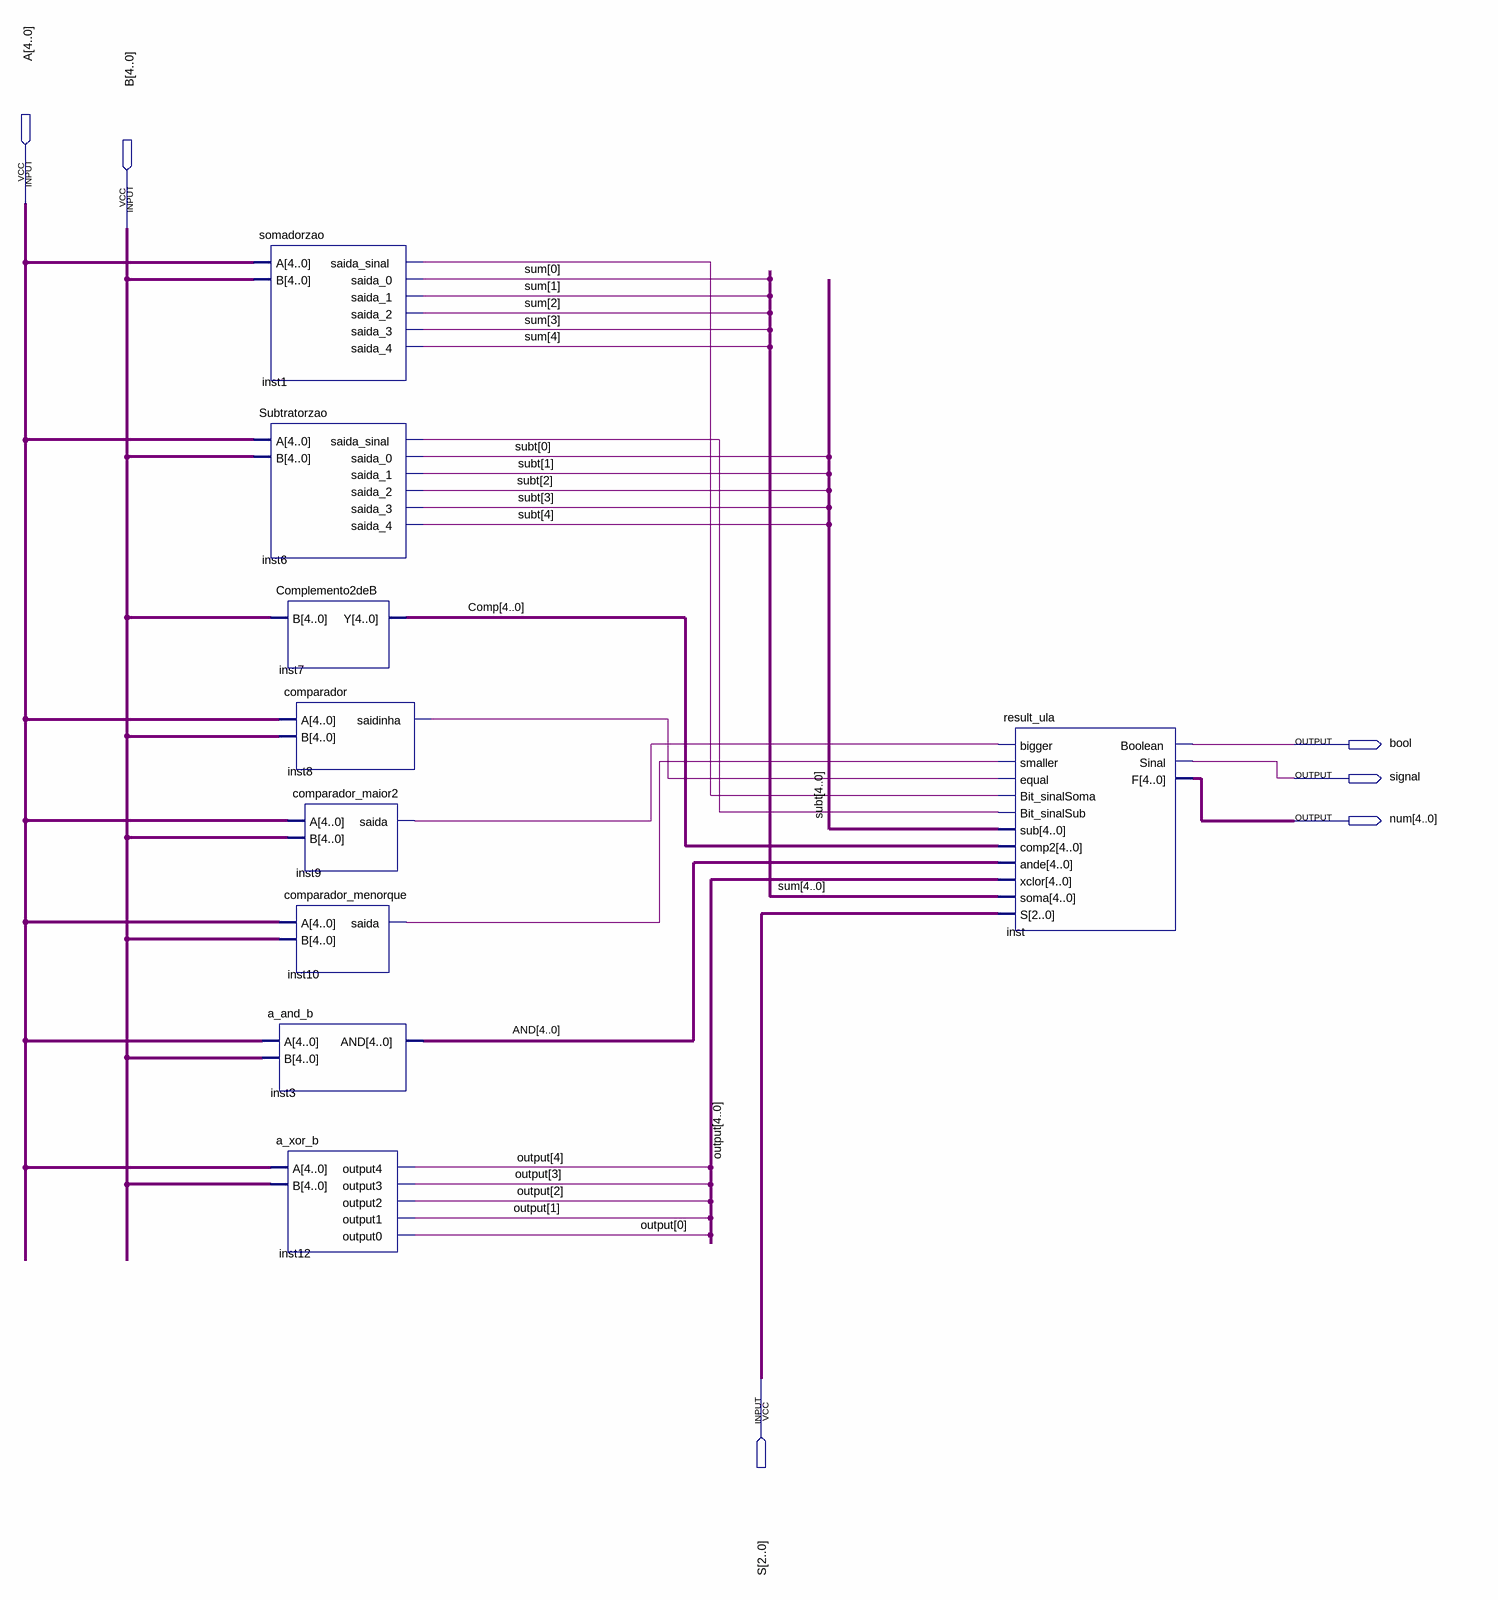
[diagram p0: schematic sheet]
// Quartus schematic Alu.bdf as structural Verilog: 9 symbols, 6 pins
module Alu (
  input  [4:0] A,
  input  [4:0] B,
  input  [2:0] S,
  output \bool ,
  output signal,
  output [4:0] num
);

  wire inst1_saida_sinal, inst6_saida_sinal, inst8_saidinha, inst9_saida, inst10_saida;
  wire [4:0] AND, Comp, \output , subt, sum;

  somadorzao inst1 (
    .A(A), .B(B), .saida_sinal(inst1_saida_sinal), .saida_0(sum[0]), .saida_1(sum[1]), .saida_2(sum[2]),
    .saida_3(sum[3]), .saida_4(sum[4]));
  Subtratorzao inst6 (
    .A(A), .B(B), .saida_sinal(inst6_saida_sinal), .saida_0(subt[0]), .saida_1(subt[1]), .saida_2(subt[2]),
    .saida_3(subt[3]), .saida_4(subt[4]));
  Complemento2deB inst7 (.B(B), .Y(Comp));
  comparador inst8 (.A(A), .B(B), .saidinha(inst8_saidinha));
  comparador_maior2 inst9 (.A(A), .B(B), .saida(inst9_saida));
  comparador_menorque inst10 (.A(A), .B(B), .saida(inst10_saida));
  a_and_b inst3 (.A(A), .B(B), .AND(AND));
  a_xor_b inst12 (
    .A(A), .B(B), .output4(\output [4]), .output3(\output [3]), .output2(\output [2]), .output1(\output [1]),
    .output0(\output [0]));
  result_ula inst (
    .bigger(inst9_saida), .smaller(inst10_saida), .equal(inst8_saidinha), .Bit_sinalSoma(inst1_saida_sinal),
    .Bit_sinalSub(inst6_saida_sinal), .sub(subt), .comp2(Comp), .ande(AND), .xclor(\output ), .soma(sum),
    .S(S), .Boolean(\bool ), .Sinal(signal), .F(num));
endmodule
